# Altium schematic sheet MCU.SchDoc
size A4
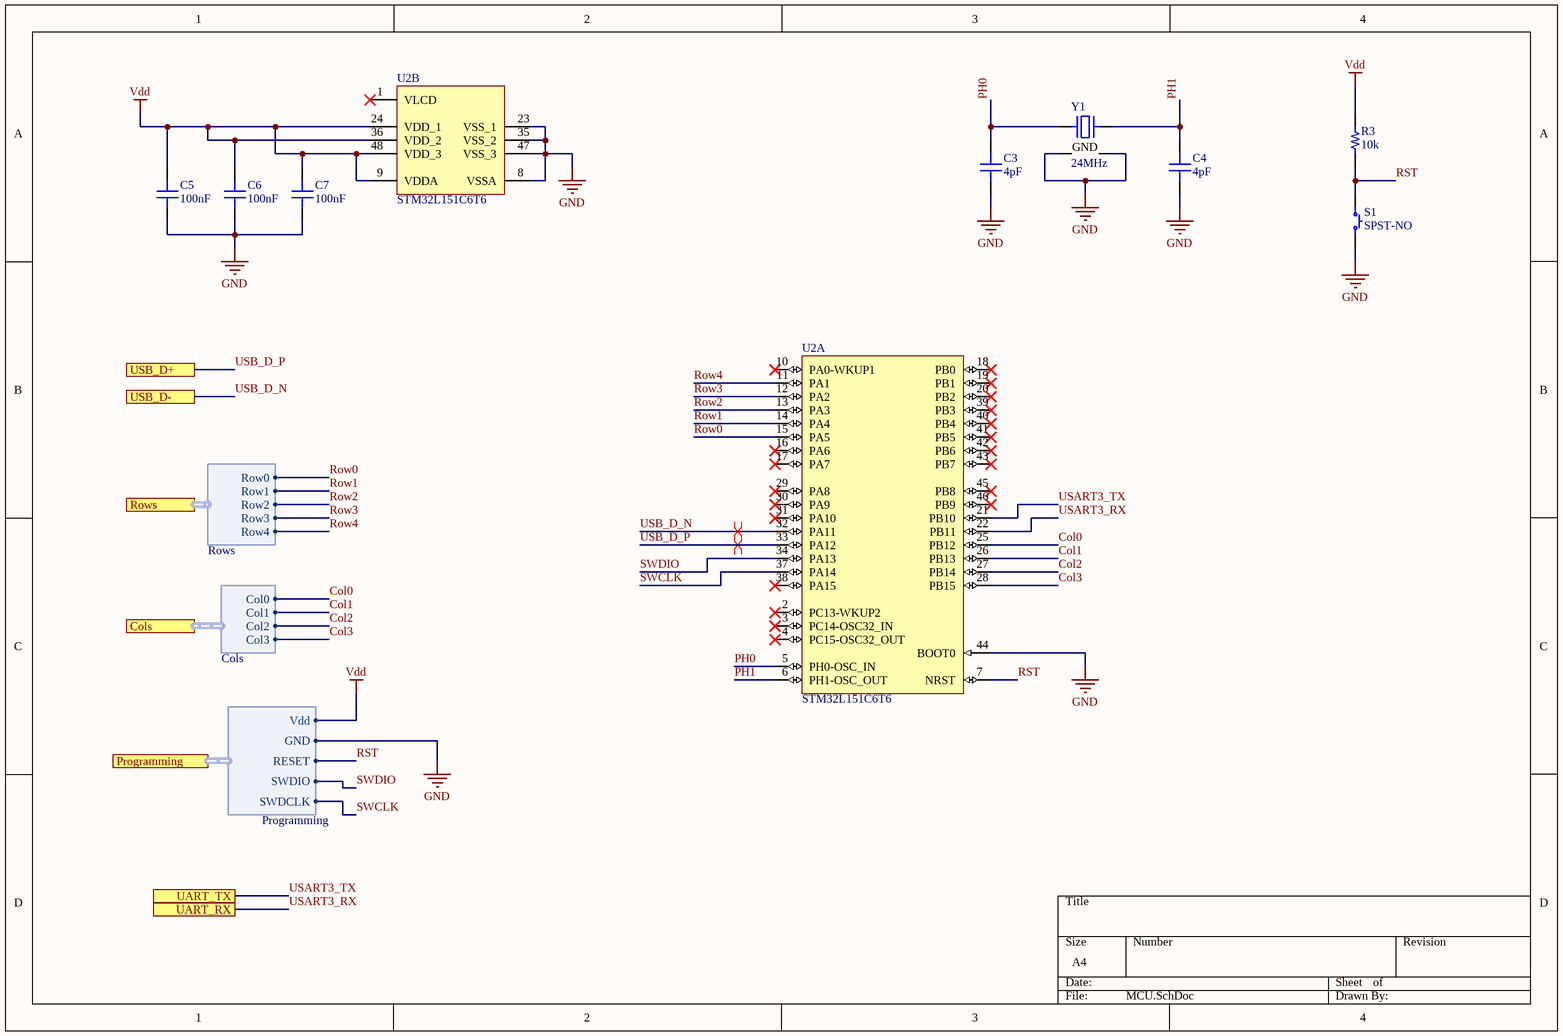
[diagram p0: MCU.SchDoc]

## Parts
C3  4pF  [CAP 0603_1608]
C4  4pF  [CAP 0603_1608]
C5  100nF  [CAP 0603_1608]
C6  100nF  [CAP 0603_1608]
C7  100nF  [CAP 0603_1608]
R3  10k  [RES 0603_1608]
S1  SPST-NO  [TE FSMSMTR]
U2  STM32L151C6T6  [STM-LQFP48_M]  (parts A,B of 2)
Y1  24MHz  [ABRACON ABM10]

## Ports
Cols (harness Cols), Programming (harness Programming), Rows (harness Rows), UART_RX, UART_TX, USB_D+, USB_D-

## Harnesses
Programming: Vdd, GND, RESET, SWDIO, SWDCLK
Rows: Row0, Row1, Row2, Row3, Row4
Cols: Col0, Col1, Col2, Col3

## Nets
GND: C3.1 C4.1 C5.1 C6.1 C7.1 S1.2 U2.8(VSSA) U2.23(VSS_1) U2.35(VSS_2) U2.44(BOOT0) U2.47(VSS_3) Y1.2(GND) Y1.4(GND) ; port Programming.GND
Vdd: C5.2 C6.2 C7.2 R3.2 U2.9(VDDA) U2.24(VDD_1) U2.36(VDD_2) U2.48(VDD_3) ; port Programming.Vdd
Col0: U2.25(PB12) ; port Cols.Col0
Col1: U2.26(PB13) ; port Cols.Col1
Col2: U2.27(PB14) ; port Cols.Col2
Col3: U2.28(PB15) ; port Cols.Col3
PH0: C3.2 U2.5(PH0-OSC_IN) Y1.1
PH1: C4.2 U2.6(PH1-OSC_OUT) Y1.3
Row0: U2.15(PA5) ; port Rows.Row0
Row1: U2.14(PA4) ; port Rows.Row1
Row2: U2.13(PA3) ; port Rows.Row2
Row3: U2.12(PA2) ; port Rows.Row3
Row4: U2.11(PA1) ; port Rows.Row4
RST: R3.1 S1.1 U2.7(NRST) ; port Programming.RESET
SWCLK: U2.37(PA14) ; port Programming.SWDCLK
SWDIO: U2.34(PA13) ; port Programming.SWDIO
USART3_RX: U2.22(PB11) ; port UART_RX
USART3_TX: U2.21(PB10) ; port UART_TX
USB_D_N: U2.32(PA11) ; port USB_D-
USB_D_P: U2.33(PA12) ; port USB_D+

Not connected (* = marked no-connect by the designer): U2 1(VLCD)* 2(PC13-WKUP2)* 3(PC14-OSC32_IN)* 4(PC15-OSC32_OUT)* 10(PA0-WKUP1)* 16(PA6)* 17(PA7)* 18(PB0)* 19(PB1)* 20(PB2)* 29(PA8)* 30(PA9)* 31(PA10)* 38(PA15)* 39(PB3)* 40(PB4)* 41(PB5)* 42(PB6)* 43(PB7)* 45(PB8)* 46(PB9)*

## Layout directives
differential pair; differential pair class USB_PHY: USB_D_N, USB_D_P

## Library data of the parts
C3-C7 = Capacitor: SMT Capacitor
R3 = Resistor: SMT Resistor
S1 = SPST-NO 2 PIN
U2 = CMP-0236-00051-2: ARM Cortex-M3 32-bit MCU, 32 KB Flash, 10 KB Internal RAM, 37 I/Os, 48-pin LQFP, -40 to 85 degC, Tray; Operating Frequency(F) (Processor speed) (MHz): 32; Data E2PROM nom (B): 4096; Internal RAM Size (kB): 10; D/A Converter: 2x12-bit (2 Channel); Supply Voltage(Vcc) min (V): 1.65; I/Os (High Current): 37; ComponentLink2Description: Datasheet; Core: ARM Cortex-M3; PackageDescription: 48-Pin Low Profile Quad Flat Package, 7 x 7 mm Body, 0.5 mm Pitch; PackageReference: LQFP48; PartNumber: STM32L151C6T6; DatasheetVersion: Rev. 8; PackageVersion: Rev. 6, 06/2013; FLASH Size (Prog) (kB): 32; ComponentLink1URL: http://www.st.com/web/en/home.html; ComponentLink3URL: http://www.st.com/st-web-ui/static/active/en/resource/technical/document/datasheet/DM00058181.pdf; ComponentLink3Description: Package Specification; Packing: Tray; ComponentLink1Description: Manufacturer URL; Mounting Technology: Surface Mount; ComponentLink2URL: http://www.st.com/st-web-ui/static/active/en/resource/technical/document/datasheet/CD00277537.pdf
Y1 = Abracon Crystal ABM10: SMT Crystal